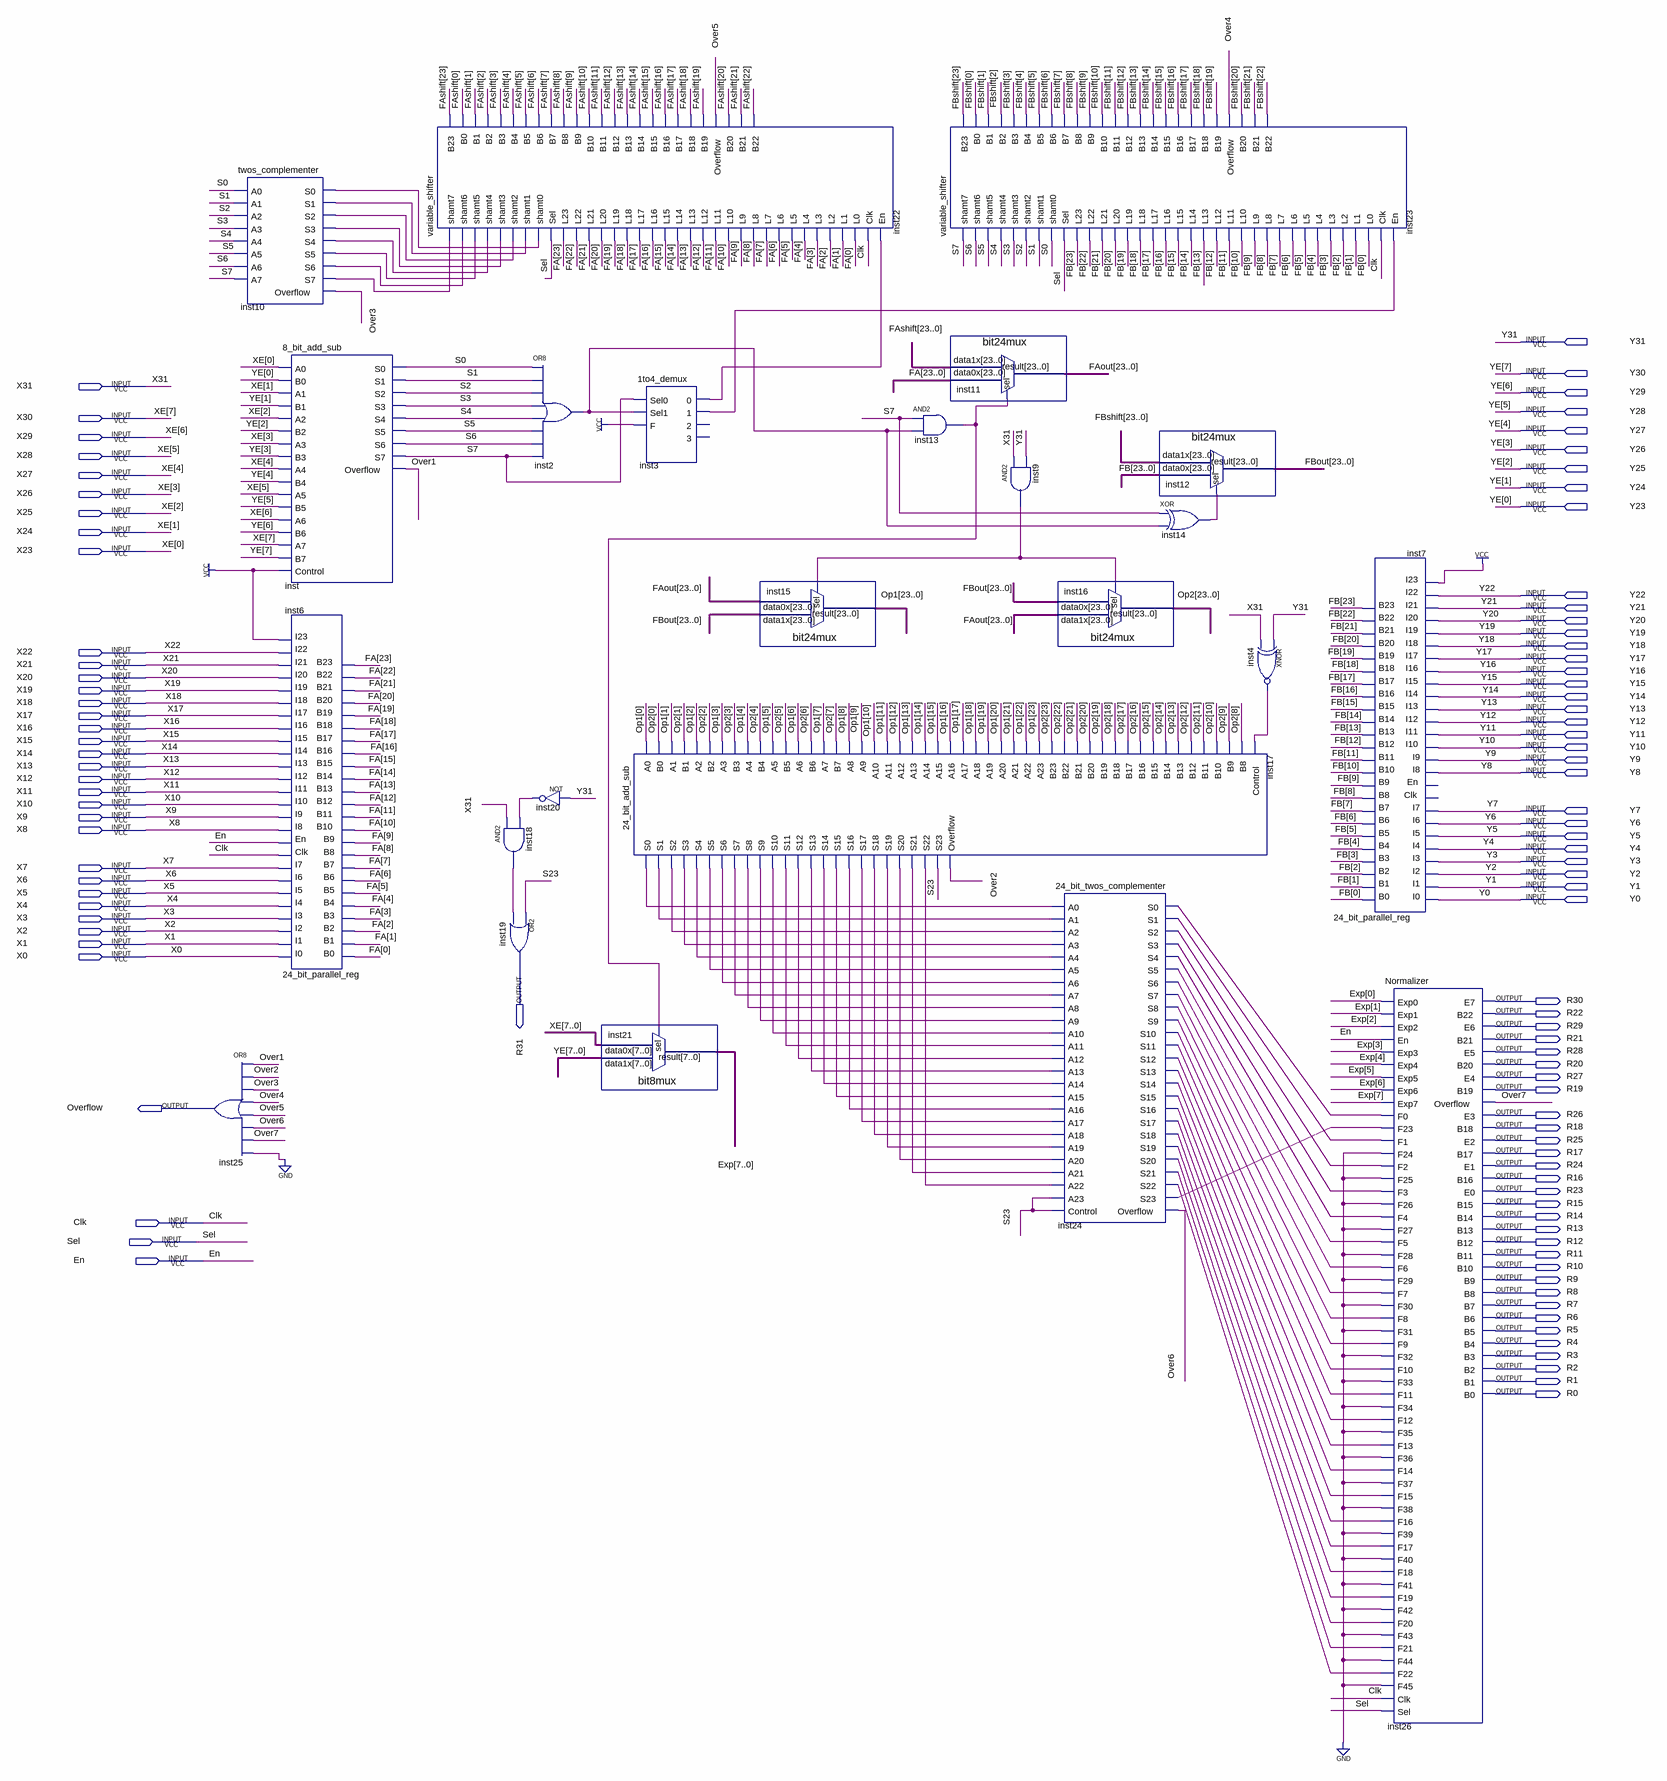
[diagram p0: schematic sheet]
// Quartus schematic Subtraction.bdf as structural Verilog: 24 symbols, 100 pins
module Subtraction (
  input  Y31,
  input  Y30,
  input  X31,
  input  Y29,
  input  Y28,
  input  X30,
  input  Y27,
  input  X29,
  input  Y26,
  input  X28,
  input  Y25,
  input  X27,
  input  Y24,
  input  X26,
  input  Y23,
  input  X25,
  input  X24,
  input  X23,
  input  Y22,
  input  Y21,
  input  Y20,
  input  Y19,
  input  Y18,
  input  X22,
  input  Y17,
  input  X21,
  input  Y16,
  input  X20,
  input  Y15,
  input  X19,
  input  Y14,
  input  X18,
  input  Y13,
  input  X17,
  input  Y12,
  input  X16,
  input  Y11,
  input  X15,
  input  Y10,
  input  X14,
  input  Y9,
  input  X13,
  input  Y8,
  input  X12,
  input  X11,
  input  X10,
  input  Y7,
  input  X9,
  input  Y6,
  input  X8,
  input  Y5,
  input  Y4,
  input  Y3,
  input  X7,
  input  Y2,
  input  X6,
  input  Y1,
  input  X5,
  input  Y0,
  input  X4,
  input  X3,
  input  X2,
  input  X1,
  input  X0,
  input  Clk,
  input  Sel,
  input  En,
  output R31,
  output R30,
  output R22,
  output R29,
  output R21,
  output R28,
  output R20,
  output R27,
  output R19,
  output Overflow,
  output R26,
  output R18,
  output R25,
  output R17,
  output R24,
  output R16,
  output R23,
  output R15,
  output R14,
  output R13,
  output R12,
  output R11,
  output R10,
  output R9,
  output R8,
  output R7,
  output R6,
  output R5,
  output R4,
  output R3,
  output R2,
  output R1,
  output R0
);

  wire inst2_out, inst3_0, inst3_1, inst4_out, inst9_out, inst10_s0, inst10_s1, inst10_s2, inst10_s3,
       inst10_s4, inst10_s5, inst10_s6, inst10_s7, inst13_out, inst14_out, inst17_s0, inst17_s1, inst17_s2,
       inst17_s3, inst17_s4, inst17_s5, inst17_s6, inst17_s7, inst17_s8, inst17_s9, inst17_s10, inst17_s11,
       inst17_s12, inst17_s13, inst17_s14, inst17_s15, inst17_s16, inst17_s17, inst17_s18, inst17_s19,
       inst17_s20, inst17_s21, inst17_s22, inst18_out, inst20_out, inst24_s0, inst24_s1, inst24_s2,
       inst24_s3, inst24_s4, inst24_s5, inst24_s6, inst24_s7, inst24_s8, inst24_s9, inst24_s10, inst24_s11,
       inst24_s12, inst24_s13, inst24_s14, inst24_s15, inst24_s16, inst24_s17, inst24_s18, inst24_s19,
       inst24_s20, inst24_s21, inst24_s22, inst24_s23, Over1, Over2, Over3, Over4, Over5, Over6, Over7, S0,
       S1, S2, S3, S4, S5, S6, S7, S23;
  wire [7:0] Exp;
  wire [23:0] FA, FAout, FAshift, FB, FBout, FBshift, Op1, Op2;

  or inst25 (Overflow, Over1, Over2, Over3, Over4, Over5, Over6, Over7, 1'b0);
  twos_complementer inst10 (
    .A0(S0), .A1(S1), .A2(S2), .A3(S3), .A4(S4), .A5(S5), .A6(S6), .A7(S7), .S0(inst10_s0), .S1(inst10_s1),
    .S2(inst10_s2), .S3(inst10_s3), .S4(inst10_s4), .S5(inst10_s5), .S6(inst10_s6), .S7(inst10_s7),
    .Overflow(Over3));
  \8_bit_add_sub  inst (
    .A0(X23), .B0(Y23), .A1(X24), .B1(Y24), .A2(X25), .B2(Y25), .A3(X26), .B3(Y26), .A4(X27), .B4(Y27),
    .A5(X28), .B5(Y28), .A6(X29), .B6(Y29), .A7(X30), .B7(Y30), .Control(1'b1), .S0(S0), .S1(S1), .S2(S2),
    .S3(S3), .S4(S4), .S5(S5), .S6(S6), .S7(S7), .Overflow(Over1));
  \24_bit_parallel_reg  inst6 (
    .I0(X0), .I1(X1), .I2(X2), .I3(X3), .I4(X4), .I5(X5), .I6(X6), .I7(X7), .Clk(Clk), .En(En), .I8(X8),
    .I9(X9), .I10(X10), .I11(X11), .I12(X12), .I13(X13), .I14(X14), .I15(X15), .I16(X16), .I17(X17),
    .I18(X18), .I19(X19), .I20(X20), .I21(X21), .I22(X22), .I23(1'b1), .B0(FA[0]), .B1(FA[1]), .B2(FA[2]),
    .B3(FA[3]), .B4(FA[4]), .B5(FA[5]), .B6(FA[6]), .B7(FA[7]), .B8(FA[8]), .B9(FA[9]), .B10(FA[10]),
    .B11(FA[11]), .B12(FA[12]), .B13(FA[13]), .B14(FA[14]), .B15(FA[15]), .B16(FA[16]), .B17(FA[17]),
    .B18(FA[18]), .B19(FA[19]), .B20(FA[20]), .B21(FA[21]), .B22(FA[22]), .B23(FA[23]));
  variable_shifter inst22 (
    .shamt7(inst10_s7), .shamt6(inst10_s6), .shamt5(inst10_s5), .shamt4(inst10_s4), .shamt3(inst10_s3),
    .shamt2(inst10_s2), .shamt1(inst10_s1), .shamt0(inst10_s0), .Sel(Sel), .L23(FA[23]), .L22(FA[22]),
    .L21(FA[21]), .L20(FA[20]), .L19(FA[19]), .L18(FA[18]), .L17(FA[17]), .L16(FA[16]), .L15(FA[15]),
    .L14(FA[14]), .L13(FA[13]), .L12(FA[12]), .L11(FA[11]), .L10(FA[10]), .L9(FA[9]), .L8(FA[8]), .L7(FA[7]),
    .L6(FA[6]), .L5(FA[5]), .L4(FA[4]), .L3(FA[3]), .L2(FA[2]), .L1(FA[1]), .L0(FA[0]), .Clk(Clk),
    .En(inst3_0), .B23(FAshift[23]), .B0(FAshift[0]), .B1(FAshift[1]), .B2(FAshift[2]), .B3(FAshift[3]),
    .B4(FAshift[4]), .B5(FAshift[5]), .B6(FAshift[6]), .B7(FAshift[7]), .B8(FAshift[8]), .B9(FAshift[9]),
    .B10(FAshift[10]), .B11(FAshift[11]), .B12(FAshift[12]), .B13(FAshift[13]), .B14(FAshift[14]),
    .B15(FAshift[15]), .B16(FAshift[16]), .B17(FAshift[17]), .B18(FAshift[18]), .B19(FAshift[19]),
    .Overflow(Over5), .B20(FAshift[20]), .B21(FAshift[21]), .B22(FAshift[22]));
  or inst2 (inst2_out, S0, S1, S2, S3, S4, S5, S6, S7);
  not inst20 (inst20_out, Y31);
  and inst18 (inst18_out, X31, inst20_out);
  or inst19 (R31, S23, inst18_out);
  \1to4_demux  inst3 (.Sel0(S7), .Sel1(inst2_out), .F(1'b1), .\0 (inst3_0), .\1 (inst3_1));  // open: 2, 3
  \24_bit_add_sub  inst17 (
    .A0(Op1[0]), .B0(Op2[0]), .A1(Op1[1]), .B1(Op2[1]), .A2(Op1[2]), .B2(Op2[2]), .A3(Op1[3]), .B3(Op2[3]),
    .A4(Op1[4]), .B4(Op2[4]), .A5(Op1[5]), .B5(Op2[5]), .A6(Op1[6]), .B6(Op2[6]), .A7(Op1[7]), .B7(Op2[7]),
    .A8(Op1[8]), .A9(Op1[9]), .A10(Op1[10]), .A11(Op1[11]), .A12(Op1[12]), .A13(Op1[13]), .A14(Op1[14]),
    .A15(Op1[15]), .A16(Op1[16]), .A17(Op1[17]), .A18(Op1[18]), .A19(Op1[19]), .A20(Op1[20]), .A21(Op1[21]),
    .A22(Op1[22]), .A23(Op1[23]), .B23(Op2[23]), .B22(Op2[22]), .B21(Op2[21]), .B20(Op2[20]), .B19(Op2[19]),
    .B18(Op2[18]), .B17(Op2[17]), .B16(Op2[16]), .B15(Op2[15]), .B14(Op2[14]), .B13(Op2[13]), .B12(Op2[12]),
    .B11(Op2[11]), .B10(Op2[10]), .B9(Op2[9]), .B8(Op2[8]), .Control(inst4_out), .S0(inst17_s0),
    .S1(inst17_s1), .S2(inst17_s2), .S3(inst17_s3), .S4(inst17_s4), .S5(inst17_s5), .S6(inst17_s6),
    .S7(inst17_s7), .S8(inst17_s8), .S9(inst17_s9), .S10(inst17_s10), .S11(inst17_s11), .S12(inst17_s12),
    .S13(inst17_s13), .S14(inst17_s14), .S15(inst17_s15), .S16(inst17_s16), .S17(inst17_s17),
    .S18(inst17_s18), .S19(inst17_s19), .S20(inst17_s20), .S21(inst17_s21), .S22(inst17_s22), .S23(S23),
    .Overflow(Over2));
  bit8mux inst21 (
    .data1x({Y30, Y29, Y28, Y27, Y26, Y25, Y24, Y23}), .data0x({X30, X29, X28, X27, X26, X25, X24, X23}),
    .sel(inst13_out), .result(Exp));
  bit24mux inst15 (.data1x(FBout), .data0x(FAout), .sel(inst9_out), .result(Op1));
  variable_shifter inst23 (
    .shamt7(S7), .shamt6(S6), .shamt5(S5), .shamt4(S4), .shamt3(S3), .shamt2(S2), .shamt1(S1), .shamt0(S0),
    .Sel(Sel), .L23(FB[23]), .L22(FB[22]), .L21(FB[21]), .L20(FB[20]), .L19(FB[19]), .L18(FB[18]),
    .L17(FB[17]), .L16(FB[16]), .L15(FB[15]), .L14(FB[14]), .L13(FB[13]), .L12(FB[12]), .L11(FB[11]),
    .L10(FB[10]), .L9(FB[9]), .L8(FB[8]), .L7(FB[7]), .L6(FB[6]), .L5(FB[5]), .L4(FB[4]), .L3(FB[3]),
    .L2(FB[2]), .L1(FB[1]), .L0(FB[0]), .Clk(Clk), .En(inst3_1), .B23(FBshift[23]), .B0(FBshift[0]),
    .B1(FBshift[1]), .B2(FBshift[2]), .B3(FBshift[3]), .B4(FBshift[4]), .B5(FBshift[5]), .B6(FBshift[6]),
    .B7(FBshift[7]), .B8(FBshift[8]), .B9(FBshift[9]), .B10(FBshift[10]), .B11(FBshift[11]),
    .B12(FBshift[12]), .B13(FBshift[13]), .B14(FBshift[14]), .B15(FBshift[15]), .B16(FBshift[16]),
    .B17(FBshift[17]), .B18(FBshift[18]), .B19(FBshift[19]), .Overflow(Over4), .B20(FBshift[20]),
    .B21(FBshift[21]), .B22(FBshift[22]));
  and inst13 (inst13_out, S7, inst2_out);
  bit24mux inst11 (.data1x(FAshift), .data0x(FA), .sel(inst13_out), .result(FAout));
  and inst9 (inst9_out, X31, Y31);
  bit24mux inst16 (.data1x(FAout), .data0x(FBout), .sel(inst9_out), .result(Op2));
  \24_bit_twos_complementer  inst24 (
    .A0(inst17_s0), .A1(inst17_s1), .A2(inst17_s2), .A3(inst17_s3), .A4(inst17_s4), .A5(inst17_s5),
    .A6(inst17_s6), .A7(inst17_s7), .A8(inst17_s8), .A9(inst17_s9), .A10(inst17_s10), .A11(inst17_s11),
    .A12(inst17_s12), .A13(inst17_s13), .A14(inst17_s14), .A15(inst17_s15), .A16(inst17_s16),
    .A17(inst17_s17), .A18(inst17_s18), .A19(inst17_s19), .A20(inst17_s20), .A21(inst17_s21),
    .A22(inst17_s22), .A23(S23), .Control(S23), .S0(inst24_s0), .S1(inst24_s1), .S2(inst24_s2),
    .S3(inst24_s3), .S4(inst24_s4), .S5(inst24_s5), .S6(inst24_s6), .S7(inst24_s7), .S8(inst24_s8),
    .S9(inst24_s9), .S10(inst24_s10), .S11(inst24_s11), .S12(inst24_s12), .S13(inst24_s13), .S14(inst24_s14),
    .S15(inst24_s15), .S16(inst24_s16), .S17(inst24_s17), .S18(inst24_s18), .S19(inst24_s19),
    .S20(inst24_s20), .S21(inst24_s21), .S22(inst24_s22), .S23(inst24_s23), .Overflow(Over6));
  bit24mux inst12 (.data1x(FBshift), .data0x(FB), .sel(inst14_out), .result(FBout));
  xor inst14 (inst14_out, S7, inst2_out);
  xnor inst4 (inst4_out, Y31, X31);
  \24_bit_parallel_reg  inst7 (
    .I0(Y0), .I1(Y1), .I2(Y2), .I3(Y3), .I4(Y4), .I5(Y5), .I6(Y6), .I7(Y7), .I8(Y8), .I9(Y9), .I10(Y10),
    .I11(Y11), .I12(Y12), .I13(Y13), .I14(Y14), .I15(Y15), .I16(Y16), .I17(Y17), .I18(Y18), .I19(Y19),
    .I20(Y20), .I21(Y21), .I22(Y22), .I23(1'b1), .B0(FB[0]), .B1(FB[1]), .B2(FB[2]), .B3(FB[3]), .B4(FB[4]),
    .B5(FB[5]), .B6(FB[6]), .B7(FB[7]), .B8(FB[8]), .B9(FB[9]), .B10(FB[10]), .B11(FB[11]), .B12(FB[12]),
    .B13(FB[13]), .B14(FB[14]), .B15(FB[15]), .B16(FB[16]), .B17(FB[17]), .B18(FB[18]), .B19(FB[19]),
    .B20(FB[20]), .B21(FB[21]), .B22(FB[22]), .B23(FB[23]));  // open: Clk, En
  Normalizer inst26 (
    .Exp0(Exp[0]), .Exp1(Exp[1]), .Exp2(Exp[2]), .En(En), .Exp3(Exp[3]), .Exp4(Exp[4]), .Exp5(Exp[5]),
    .Exp6(Exp[6]), .Exp7(Exp[7]), .F0(inst24_s0), .F23(inst24_s23), .F1(inst24_s1), .F24(1'b0),
    .F2(inst24_s2), .F25(1'b0), .F3(inst24_s3), .F26(1'b0), .F4(inst24_s4), .F27(1'b0), .F5(inst24_s5),
    .F28(1'b0), .F6(inst24_s6), .F29(1'b0), .F7(inst24_s7), .F30(1'b0), .F8(inst24_s8), .F31(1'b0),
    .F9(inst24_s9), .F32(1'b0), .F10(inst24_s10), .F33(1'b0), .F11(inst24_s11), .F34(1'b0), .F12(inst24_s12),
    .F35(1'b0), .F13(inst24_s13), .F36(1'b0), .F14(inst24_s14), .F37(1'b0), .F15(inst24_s15), .F38(1'b0),
    .F16(inst24_s16), .F39(1'b0), .F17(inst24_s17), .F40(1'b0), .F18(inst24_s18), .F41(1'b0),
    .F19(inst24_s19), .F42(1'b0), .F20(inst24_s20), .F43(1'b0), .F21(inst24_s21), .F44(1'b0),
    .F22(inst24_s22), .F45(1'b0), .Clk(Clk), .Sel(Sel), .E7(R30), .B22(R22), .E6(R29), .B21(R21), .E5(R28),
    .B20(R20), .E4(R27), .B19(R19), .Overflow(Over7), .E3(R26), .B18(R18), .E2(R25), .B17(R17), .E1(R24),
    .B16(R16), .E0(R23), .B15(R15), .B14(R14), .B13(R13), .B12(R12), .B11(R11), .B10(R10), .B9(R9), .B8(R8),
    .B7(R7), .B6(R6), .B5(R5), .B4(R4), .B3(R3), .B2(R2), .B1(R1), .B0(R0));

  // Other names for the same wires on the sheet: XE[7:0] = {X30, X29, X28, X27, X26, X25, X24, X23};
  //   YE[7:0] = {Y30, Y29, Y28, Y27, Y26, Y25, Y24, Y23}
endmodule
